# EAGLE design ARM_critter_prog_v01 (EAGLE 6.1)
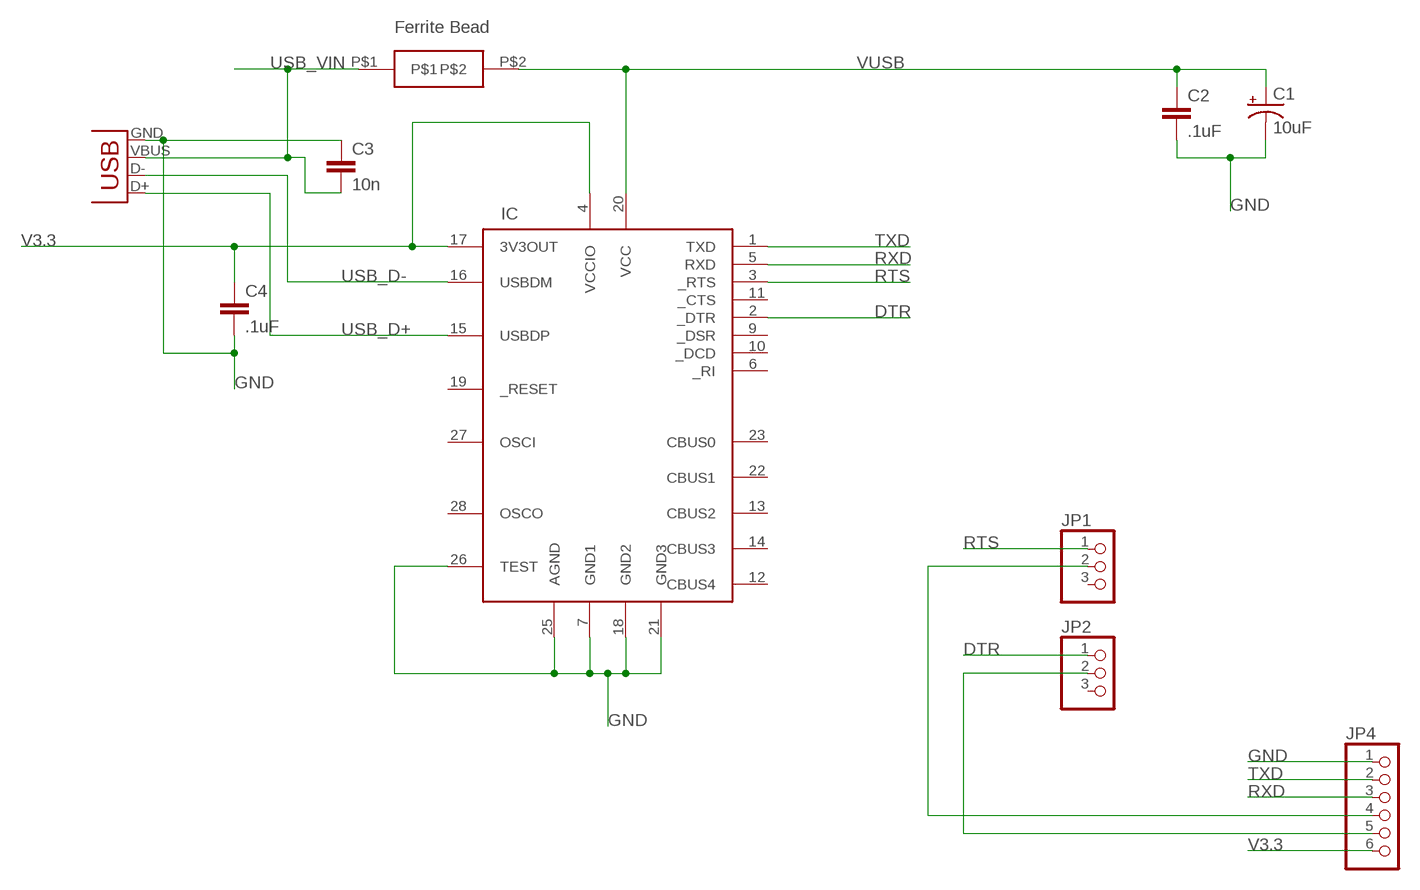
[diagram p0: schematic, sheet 1]

## Parts
C1  10uF  CAP_POL1206  [CPOL_1206]
C2  .1uF  CAP0603  [C0603]
C3  10n  CAP0603  [C0603]
C4  .1uF  CAP0603  [C0603]
IC  FT232RL  [SSOP28DB]
JP1  PINHD-1X3  [1X03]
JP2  PINHD-1X3  [1X03]
JP4  PINHD-1X6  [1X06]
U$1  FERRITE_BEAD  [FERRITE_BEAD]
X2  USB-B-H  [USB-B-H]

## Nets
DTR: IC.2(_DTR) JP2.1
GND [power]: C1.C(-) C2.2 C3.1 C4.2 IC.7(GND1) IC.18(GND2) IC.21(GND3) IC.25(AGND) IC.26(TEST) JP4.1 X2.GND
N$1: JP1.2 JP4.4
N$2: JP2.2 JP4.5
RTS: IC.3(_RTS) JP1.1
RXD: IC.5(RXD) JP4.3
TXD: IC.1(TXD) JP4.2
USB_D+: IC.15(USBDP) X2.D+
USB_D-: IC.16(USBDM) X2.D-
USB_VIN [power]: C3.2 U$1.P$1 X2.VBUS
V3.3 [power]: C4.1 IC.4(VCCIO) IC.17(3V3OUT) JP4.6
VUSB [power]: C1.A(+) C2.1 IC.20(VCC) U$1.P$2
Unconnected: IC.6(_RI) IC.9(_DSR) IC.10(_DCD) IC.11(_CTS) IC.12(CBUS4) IC.13(CBUS2) IC.14(CBUS3) IC.19(_RESET) IC.22(CBUS1) IC.23(CBUS0) IC.27(OSCI) IC.28(OSCO) JP1.3 JP2.3

## Notes on the sheet
- Ferrite Bead

## Library data of the parts
C1 = SparkFun:CAP_POL
C2-C4 = SparkFun:CAP: CAPACITOR
IC = ftdichip:FT232RL: USB UART 4th Generation USB UART (USB <-> Serial) Controller
JP1 JP2 = pinhead:PINHD-1X3: PIN HEADER
JP4 = pinhead:PINHD-1X6: PIN HEADER
U$1 = SparkFun:FERRITE_BEAD
X2 = con-usb:USB: USB Connectors

## Net classes
0 default: width 0.254 mm
1 power: width 0.406 mm

## Board
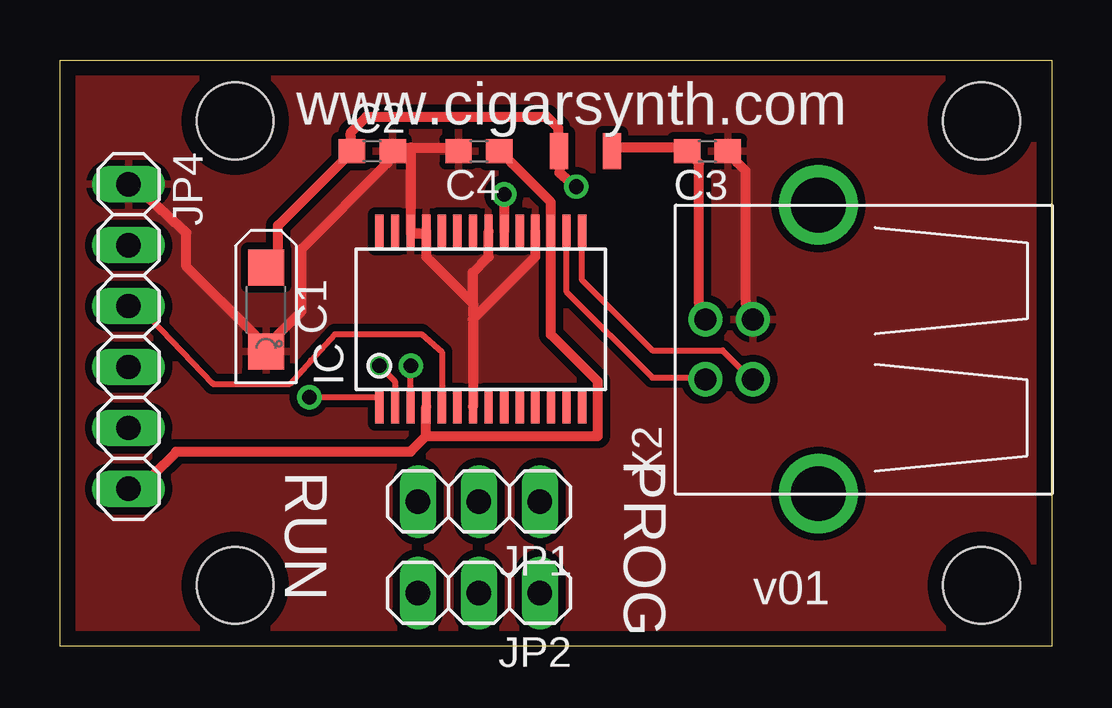
[diagram p1: board, top side]
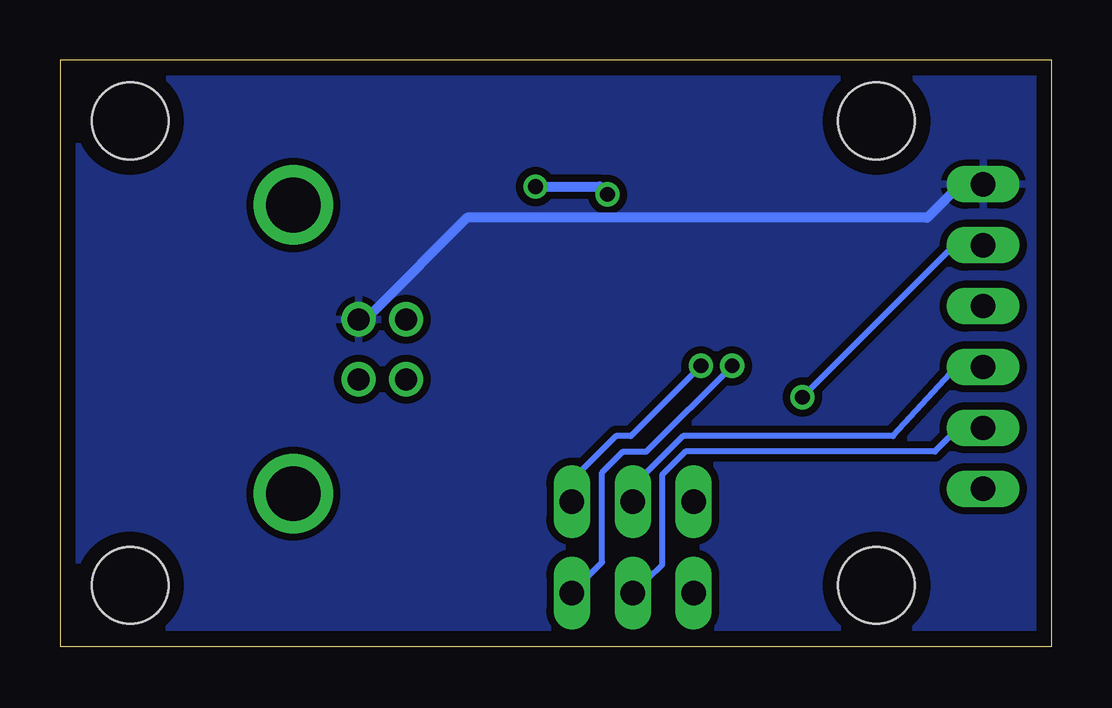
[diagram p2: board, bottom side, seen from below]

Size 41.34 x 24.45 mm. Coordinates in mm from the lower left corner, seen from the top.
Outline: 0,24.45 41.34,24.45 41.34,0 0,0 0,24.45
Copper layers (1*16): Top 0.035mm / dielectric 1.5mm / Bottom 0.035mm
Design rules: minimum track width 8mil, minimum drill 24mil, track to track 8mil, track to pad 8mil, pad to pad 8mil, via to via 8mil, smd to smd 8mil, copper to edge 25mil, drill to drill 8mil, minimum pad ring 10mil, minimum via ring 8mil, stop-mask expansion 4mil, vias tented up to drill 0mil, thermal gap 10mil
Holes 3.2 mm at 38.42,2.54 7.3,2.54 38.42,21.91 7.3,21.91

### Footprints (pad centres in the part's own frame; a part is rotated, then mirrored left to right if it is on the bottom)
CPOL_1206 = smd 1.5 x 1.5: A 0,-1.75; C 0,1.75
C0603 = smd 1.1 x 1: 1 -0.85,0; 2 0.85,0
SSOP28DB = smd 0.348 x 1.397: 1 -4.225,-3.656; 2 -3.575,-3.656; 3 -2.925,-3.656; 4 -2.275,-3.656; 5 -1.625,-3.656; 6 -0.975,-3.656; 7 -0.325,-3.656; 8 0.325,-3.656; 9 0.975,-3.656; 10 1.625,-3.656; 11 2.275,-3.656; 12 2.925,-3.656; 13 3.575,-3.656; 14 4.225,-3.656; 15 4.225,3.656; 16 3.575,3.656; 17 2.925,3.656; 18 2.275,3.656; 19 1.625,3.656; 20 0.975,3.656; 21 0.325,3.656; 22 -0.325,3.656; 23 -0.975,3.656; 24 -1.625,3.656; 25 -2.275,3.656; 26 -2.925,3.656; 27 -3.575,3.656; 28 -4.225,3.656
1X03 = drill 1.016 long: 1 -2.54,0; 2 0,0; 3 2.54,0
1X06 = drill 1.016 long: 1 -6.35,0; 2 -3.81,0; 3 -1.27,0; 4 1.27,0; 5 3.81,0; 6 6.35,0
FERRITE_BEAD = smd 0.75 x 1.5: P$1 -1.1,0; P$2 1.1,0
USB-B-H = drill 0.914: D+ 0,1.25; D- 1.981,1.25; GND 0,-1.25; VBUS 1.981,-1.25 | drill 2.286: P$1 -2.718,-6.02; P$2 -2.718,6.02

### Placement (x,y rotation side)
C1  8.59,14.04 180 top
C2  13.02,20.64 0 top
C3  26.99,20.64 180 top
C4  17.46,20.64 180 top
IC  17.54,13.64 0 top
JP1  17.46,6.03 180 top
JP2  17.46,2.22 180 top
JP4  2.86,12.92 270 top
U$1  21.91,20.64 180 top
X2  28.89,12.38 180 top

### Tracks (layer width: path | path; a pad name or v marks a point on that pad's centre or on a via)
DTR  (via drill 0.61)
  Top 0.254: v13.32,11.69 13.97,11.04 IC.2
  Bottom 0.254: v13.32,11.69 16.89,8.12 17.87,8.12 18.74,7.24 18.74,3.51 JP2.1
GND
  Top 0.406: 14.62,20.79 16.24,20.79 C4.2 | 14.62,20.79 14.29,20.79 C2.2 13.64,20.14 10.07,16.57 10.07,13.97 9.09,12.99 C1.C 8.12,12.99 5.27,15.84 5.27,17.24 3.89,18.52 JP4.1 | 14.62,20.79 IC.26 14.62,17.22 15.27,17.22 IC.25 15.27,16.24 17.22,14.29 | 17.22,14.29 17.22,15.59 17.87,16.24 IC.21 | 17.22,14.29 17.22,13.64 | 17.22,13.64 IC.7 | 17.22,13.64 19.82,16.24 IC.18 | C3.1 28.27,20.14 28.59,19.82 28.59,14.29 X2.GND
  Bottom 0.406: X2.GND 28.27,13.97 24.37,17.87 5.19,17.87 4.22,18.84 JP4.1
  pour Bottom (isolate 0.305): -0.32,25.24 42.39,25.24 42.39,-2.06 -0.32,-2.06
  pour Top (isolate 0.305): -0.79,25.88 44.77,25.88 44.77,-1.91 -0.79,-1.91
N$1
  Bottom 0.254: JP4.4 4.22,11.37 6.62,8.77 15.37,8.77 16.99,7.14 JP1.2
N$2
  Bottom 0.254: JP4.5 4.22,8.77 4.87,8.12 15.27,8.12 16.24,7.14 16.24,3.4 JP2.2
RTS  (via drill 0.61)
  Top 0.254: IC.3 v14.62,11.69
  Bottom 0.254: v14.62,11.69 17.54,8.77 18.17,8.77 19.79,7.14 JP1.1
RXD
  Top 0.254: IC.5 15.92,12.27 15.07,13.02 11.46,13.02 10.46,11.92 9.58,10.94 6.37,10.94 6.37,10.97 3.79,13.64 JP4.3
TXD  (via drill 0.61)
  Top 0.254: v10.39,10.39 13.32,10.39 IC.1
  Bottom 0.254: v10.39,10.39 4.22,16.57 JP4.2
USB_D+
  Top 0.254: IC.15 21.77,15.27 24.69,12.34 27.62,12.34 28.89,11.07
  Top 0.305: 28.92,11.04 28.89,11.07 X2.D+
USB_D-
  Top 0.254: IC.16 21.12,14.78 24.69,11.2 26.97,11.2
  Top 0.305: 26.97,11.2 26.91,11.15 X2.D-
USB_VIN
  Top 0.406: U$1.P$1 23.07,20.79 25.67,20.79 C3.2 26.64,20.14 26.64,14.29 X2.VBUS
V3.3
  Top 0.406: C4.1 18.84,20.14 20.47,18.52 IC.17 20.47,12.99 22.42,11.04 22.42,8.77 15.27,8.77 | 15.27,8.77 14.62,8.12 4.84,8.12 4.84,8.09 3.89,7.14 JP4.6 | 15.27,8.77 IC.4
VUSB  (via drill 0.61)
  Top 0.406: v21.52,19.17 20.82,19.74 U$1.P$2 20.77,21.62 20.29,22.09 12.77,22.09 12.77,22.07 12.12,21.42 C2.1 11.69,20.14 9.09,17.54 9.09,16.24 C1.A | v18.52,18.84 IC.20
  Bottom 0.406: v18.52,18.84 18.84,19.17 v21.52,19.17

### Text on the board
tPlace: www.cigarsynth.com | RUN | PROG | v01